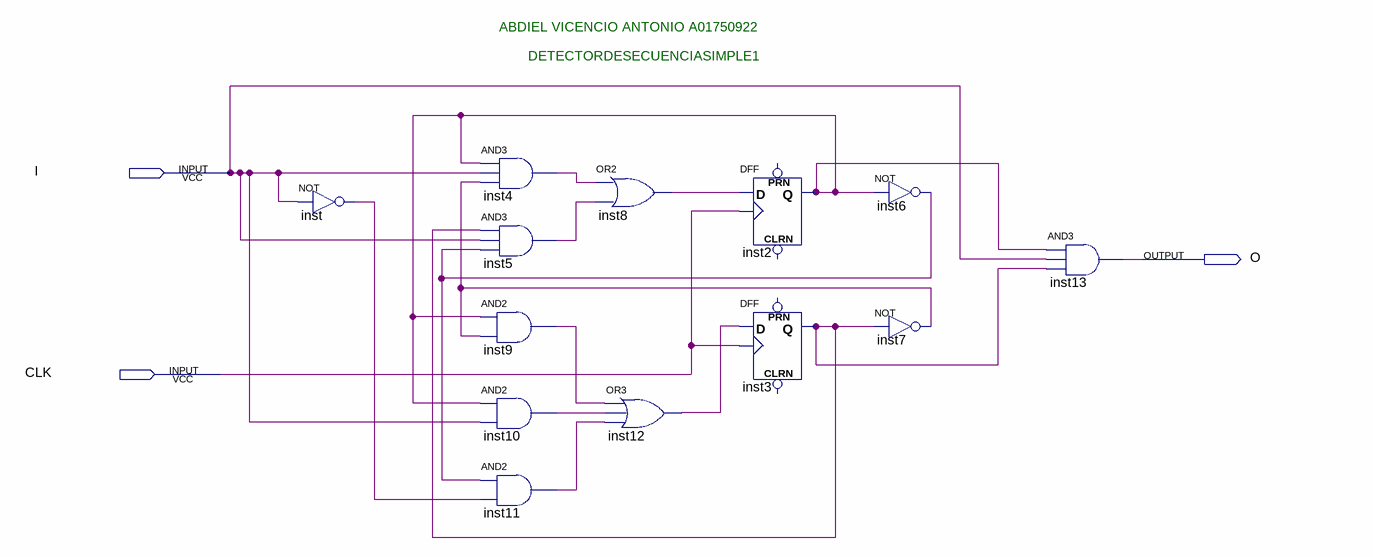
[diagram p0: schematic sheet]
// Quartus schematic DETECTORDESECUENCIASIMPLE1.bdf as structural Verilog: 13 symbols, 3 pins
module DETECTORDESECUENCIASIMPLE1 (
  input  I,
  input  CLK,
  output O
);

  wire inst2_q, inst3_q, inst4_out, inst5_out, inst6_out, inst7_out, inst8_out, inst9_out, inst10_out,
       inst11_out, inst12_out, inst_out;

  not inst (inst_out, I);
  and inst4 (inst4_out, inst2_q, I, inst7_out);
  and inst5 (inst5_out, inst3_q, I, inst6_out);
  and inst9 (inst9_out, inst2_q, inst7_out);
  and inst10 (inst10_out, inst2_q, I);
  and inst11 (inst11_out, inst6_out, inst_out);
  or inst8 (inst8_out, inst4_out, inst5_out);
  or inst12 (inst12_out, inst9_out, inst10_out, inst11_out);
  DFF inst2 (.CLK(CLK), .D(inst8_out), .Q(inst2_q));  // open: CLRN, PRN
  DFF inst3 (.CLK(CLK), .D(inst12_out), .Q(inst3_q));  // open: CLRN, PRN
  not inst6 (inst6_out, inst2_q);
  not inst7 (inst7_out, inst3_q);
  and inst13 (O, inst2_q, I, inst3_q);

  // Notes on the sheet:
  //   ABDIEL VICENCIO ANTONIO A01750922
  //   DETECTORDESECUENCIASIMPLE1
endmodule
